# EAGLE schematic fuzz-bass (EAGLE 9.6.2)
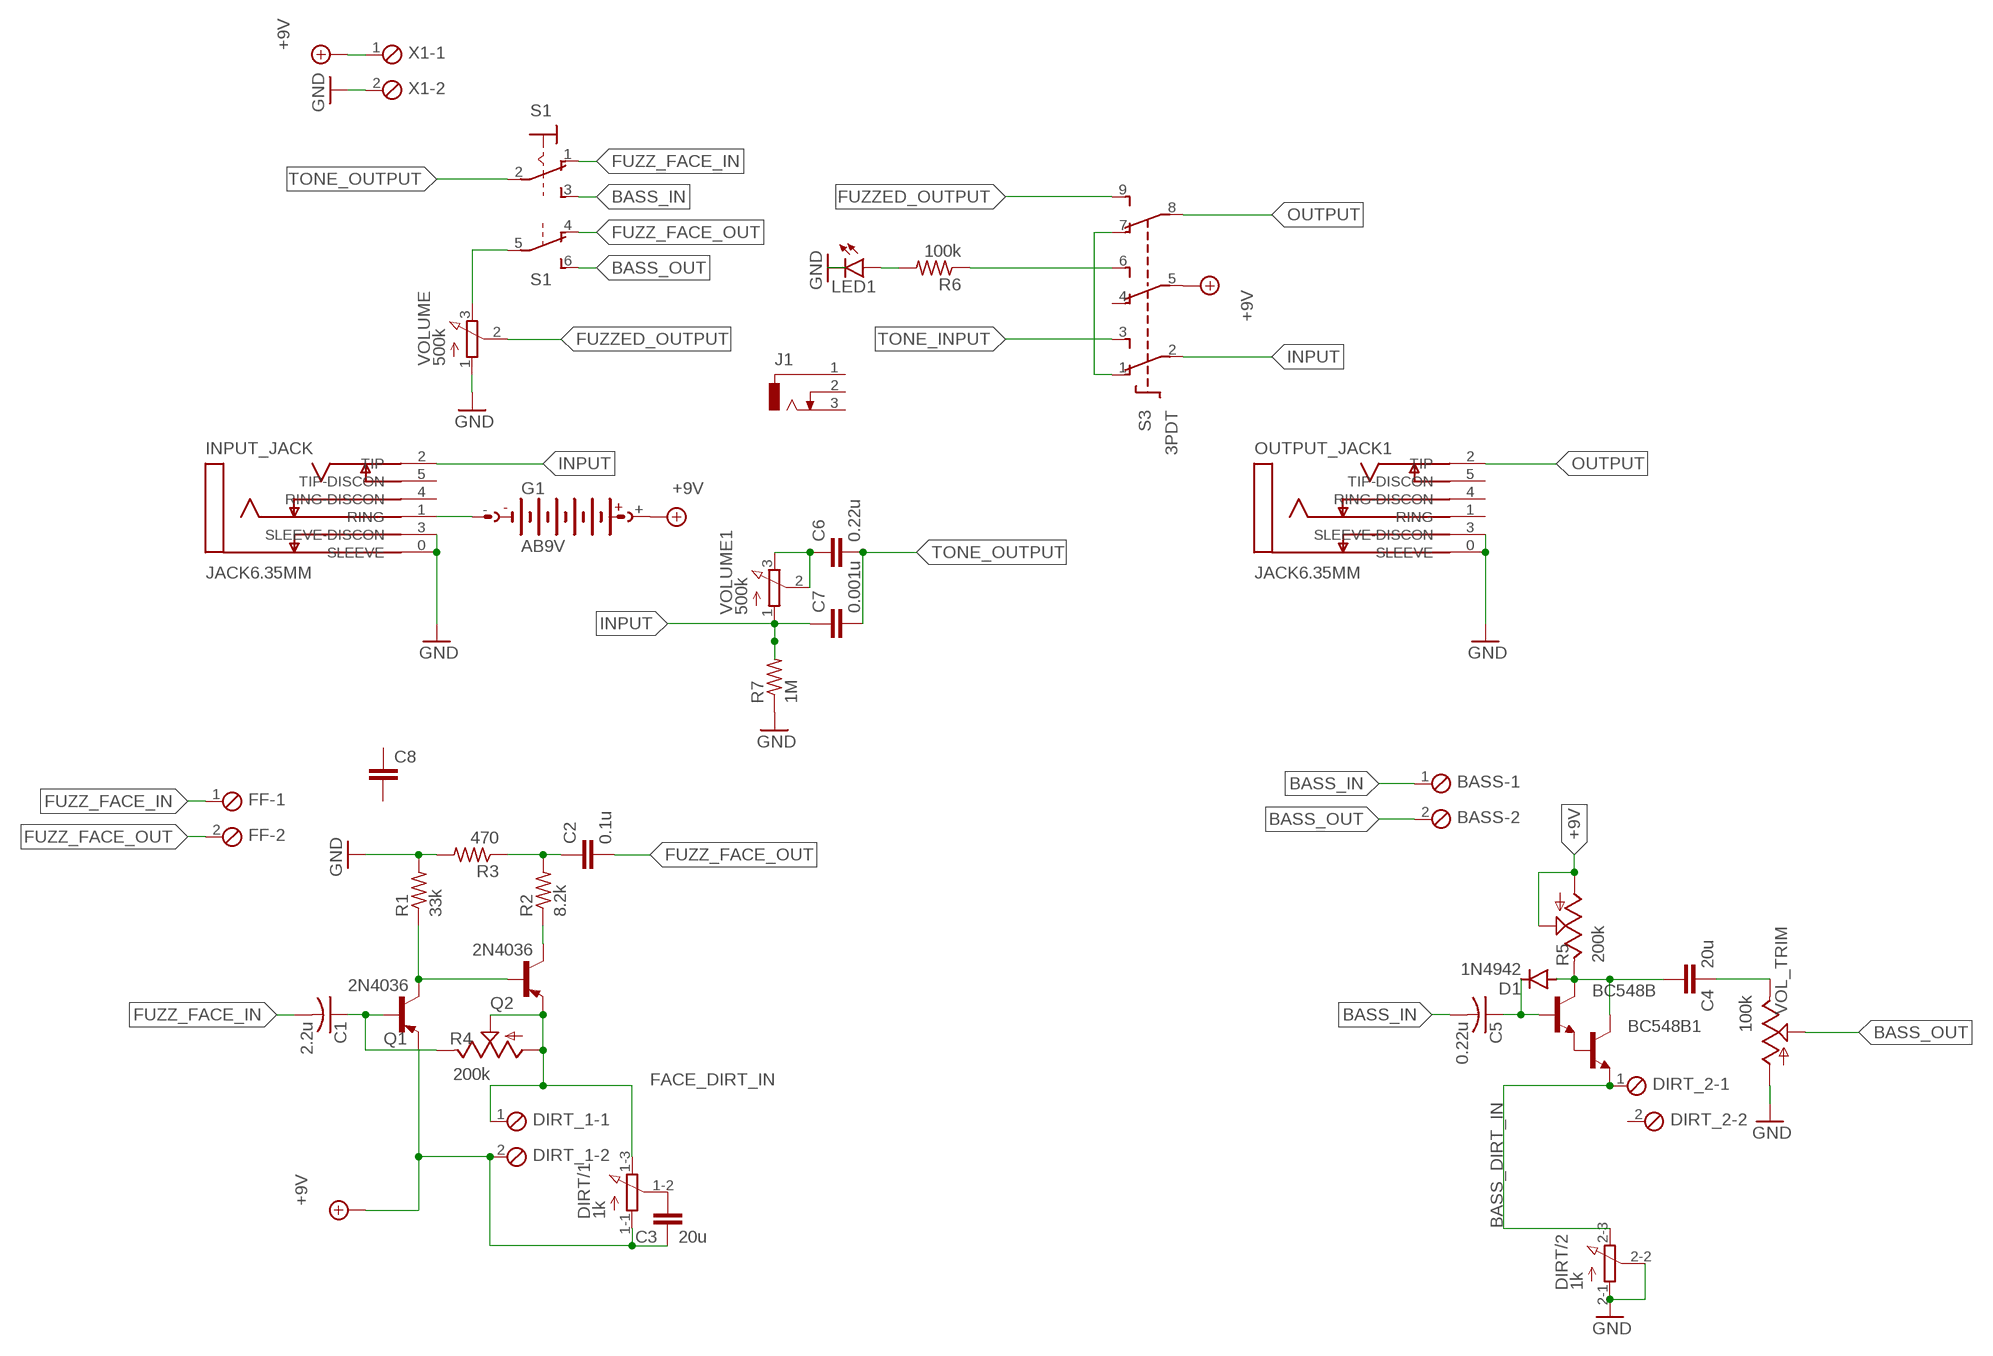
[diagram p0: schematic, sheet 1]

## Parts
BASS  MPT2  [2POL254]
BC548B  -NPN-TO92L  [TO92L]
BC548B1  -NPN-TO92L  [TO92L]
C1  2.2u  C-US025-050X050  [C025-050X050]
C2  0.1u  C-EU050-024X044  [C050-024X044]
C3  20u  C-EU025-030X050  [C025-030X050]
C4  20u  C-EU025-030X050  [C025-030X050]
C5  0.22u  C-US025-050X050  [C025-050X050]
C6  0.22u  C-EU050-024X044  [C050-024X044]
C7  0.001u  C-EU050-024X044  [C050-024X044]
C8  C-EU025-025X050  [C025-025X050]
D1  1N4942  [DO41-10]
DIRT  1k  3RP/1610G  [3RP/1610G]
DIRT_1  MPT2  [2POL254]
DIRT_2  MPT2  [2POL254]
FF  MPT2  [2POL254]
G1  AB9V  [AB9V]
INPUT_JACK  JACK6.35MM  [JACK6.35MM]
J1  DCJ0303  [DCJ0303]
LED1  LED3MM  [LED3MM]
OUTPUT_JACK1  JACK6.35MM  [JACK6.35MM]
Q1  2N4036  [TO5]
Q2  2N4036  [TO5]
R1  33k  R-US_0204/7  [0204/7]
R2  8.2k  R-US_0204/7  [0204/7]
R3  470  R-US_0204/7  [0204/7]
R4  200k  TRIM_US-RJ9W  [RJ9W]
R5  200k  TRIM_US-RJ9W  [RJ9W]
R6  100k  R-US_0204/7  [0204/7]
R7  1M  R-US_0204/7  [0204/7]
S1  M9040P2  [M9040P2]
S3  3PDT  [3PDT]
VOL_TRIM  100k  TRIM_US-RJ9W  [RJ9W]
VOLUME  500k  3RP/1610N  [3RP/1610N]
VOLUME1  500k  3RP/1610N  [3RP/1610N]
X1  MPT2  [2POL254]

## Nets
+9V: C3.1 DIRT.1-1(/1:A) DIRT_1.2 G1.+ Q1.1(E) R5.A R5.S S3.5(P2) X1.1
BASS_DIRT_IN: BC548B1.1(E) DIRT.2-3(/2:E) DIRT_2.1
BASS_IN: BASS.1 C5.2 S1.3(1:S)
BASS_OUT: BASS.2 S1.6(2:S) VOL_TRIM.S
FACE_DIRT_IN: DIRT.1-3(/1:E) DIRT_1.1 Q2.1(E) R4.A R4.S
FUZZ_FACE_IN: C1.2 FF.1 S1.1(1:O)
FUZZ_FACE_OUT: C2.2 FF.2 S1.4(2:O)
FUZZED_OUTPUT: S3.9(S3) VOLUME.2(S)
GND: DIRT.2-1(/2:A) DIRT.2-2(/2:S) INPUT_JACK.0(SLEEVE) INPUT_JACK.3(SLEEVE-DISCON) LED1.K(C) OUTPUT_JACK1.0(SLEEVE) OUTPUT_JACK1.3(SLEEVE-DISCON) R1.2 R3.2 R7.1 VOL_TRIM.A VOLUME.1(A) X1.2
INPUT: C7.1 INPUT_JACK.2(TIP) R7.2 S3.2(P1) VOLUME1.1(A)
N$1: Q2.3(C) R2.1
N$3: C1.1 Q1.2(B) R4.E
N$4: Q1.3(C) Q2.2(B) R1.1
N$5: C3.2 DIRT.1-2(/1:S)
N$6: C2.1 R2.2 R3.1
N$7: BC548B1.2(B) BC548B.1(E)
N$8: BC548B1.3(C) BC548B.3(C) C4.2 D1.A R5.E
N$9: R6.1 S3.6(S2)
N$10: LED1.A R6.2
N$11: BC548B.2(B) C5.1 D1.C
N$12: C4.1 VOL_TRIM.E
N$13: C6.1 VOLUME1.2(S) VOLUME1.3(E)
N$14: S3.1(O1) S3.7(O3)
N$15: G1.- INPUT_JACK.1(RING)
N$16: S1.5(2:P) VOLUME.3(E)
OUTPUT: OUTPUT_JACK1.2(TIP) S3.8(P3)
TONE_INPUT: S3.3(S1)
TONE_OUTPUT: C6.2 C7.2 S1.2(1:P)
Unconnected: C8.1 C8.2 DIRT_2.2 INPUT_JACK.4(RING-DISCON) INPUT_JACK.5(TIP-DISCON) J1.1 J1.2 J1.3 OUTPUT_JACK1.1(RING) OUTPUT_JACK1.4(RING-DISCON) OUTPUT_JACK1.5(TIP-DISCON) S3.4(O2)

## Library data of the parts
BASS DIRT_1 DIRT_2 FF X1 = con-phoenix-254:MPT2: PHOENIX CONNECTOR; OC_FARNELL: unknown; OC_NEWARK: unknown
BC548B BC548B1 = transistor:*-NPN-: NPN Transistror BF959 corrected 2008.03.06
C1 C5 = adafruit:C-US: CAPACITOR, American symbol
C2-C4 C6-C8 = rcl:C-EU: CAPACITOR, European symbol; SPICEPREFIX: C
D1 = diode:1N4942: DIODE 1.0 A, 200 V, 150 ns
DIRT = pot:3RP/1610G: 16mm Potentiometer two level Source: http://www.alphapotentiometers.net/html/16mm_pot_2.html
G1 = battery:AB9V: 9-V BATTERY CLIP
INPUT_JACK OUTPUT_JACK1 = jack-eagle:JACK6.35MM: Jack plug 6.35mm
J1 = con-jack:DCJ0303: DC POWER JACK Source: DCJ0303.pdf; OC_FARNELL: unknown; OC_NEWARK: unknown
LED1 = led:LED: LED OSRAM: - CHIPLED LG R971, LG N971, LY N971, LG Q971, LY Q971, LO R971, LY R971 LH N974, LH R974 LS Q976, LO Q976, LY Q976 LO Q996 - Hyper CHIPLED LW Q18S LB Q993, LB Q99A, LB R99A - SideLED LS A670, LO A670, LY A670, LG A670, LP A670 LB A673, LV A673, LT A673, LW A673 LH A674 LY A675 LS A676, LA A676, LO A676, LY A676, LW A676 LS A679, LY A679, LG A679 - Hyper Micro SIDELED® LS Y876, LA Y876, LO Y876, LY Y876 LT Y87S - SmartLED LW L88C, LW L88S LB L89C, LB L89S, LG L890 LS L89K, LO L89K, LY L89K LS L896, LA L896, LO L896, LY L896 - TOPLED LS T670, LO T670, LY T670, LG T670, LP T670 LSG T670, LSP T670, LSY T670, LOP T670, LYG T670 LG T671, LOG T671, LSG T671 LB T673, LV T673, LT T673, LW T673 LH T674 LS T676, LA T676, LO T676, LY T676, LB T676, LH T676, LSB T676, LW T676 LB T67C, LV T67C, LT T67C, LS T67K, LO T67K, LY T67K, LW E67C LS E67B, LA E67B, LO E67B, LY E67B, LB E67C, LV E67C, LT E67C LW T67C LS T679, LY T679, LG T679 LS T770, LO T770, LY T770, LG T770, LP T770 LB T773, LV T773, LT T773, LW T773 LH T774 LS E675, LA E675, LY E675, LS T675 LS T776, LA T776, LO T776, LY T776, LB T776 LHGB T686 LT T68C, LB T68C - Hyper Mini TOPLED® LB M676 - Mini TOPLED Santana® LG M470 LS M47K, LO M47K, LY M47K Source: http://www.osram.convergy.de LUXEON: - LUMILED® LXK2-PW12-R00, LXK2-PW12-S00, LXK2-PW14-U00, LXK2-PW14-V00 LXK2-PM12-R00, LXK2-PM12-S00, LXK2-PM14-U00 LXK2-PE12-Q00, LXK2-PE12-R00, LXK2-PE12-S00, LXK2-PE14-T00, LXK2-PE14-U00 LXK2-PB12-K00, LXK2-PB12-L00, LXK2-PB12-M00, LXK2-PB14-N00, LXK2-PB14-P00, LXK2-PB14-Q00 LXK2-PR12-L00, LXK2-PR12-M00, LXK2-PR14-Q00, LXK2-PR14-R00 LXK2-PD12-Q00, LXK2-PD12-R00, LXK2-PD12-S00 LXK2-PH12-R00, LXK2-PH12-S00 LXK2-PL12-P00, LXK2-PL12-Q00, LXK2-PL12-R00 Source: www.luxeon.com KINGBRIGHT: KA-3528ASYC Source: www.kingbright.com
Q1 Q2 = transistor-pnp:2N4036: PNP Transistor
R1-R3 R6 R7 = rcl:R-US_: RESISTOR, American symbol; SPICEPREFIX: R
R4 R5 VOL_TRIM = pot:TRIM_US-: POTENTIOMETER
S1 = switch:M9040P2: TOGGLE SWITCH Marquardt
S3 = switch:3PDT: 3PDT 9 pin footswitch SF17020F-0302-21R-L Source: 3PDT.jpg
VOLUME VOLUME1 = pot:3RP/1610N: 16mm Potentiometer one level Source: http://www.alphapotentiometers.net/html/16mm_pot_2.html

## Module FUZZ_FACE
Ports: 

### Library data of the parts